# EAGLE schematic rgledtest (EAGLE 9.5.2)
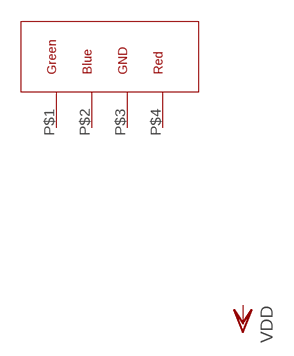
[diagram p0: schematic, sheet 1]

## Parts
U$1  RGBLED  [IC]
Unconnected: U$1.P$1 U$1.P$2 U$1.P$3 U$1.P$4

## Library data of the parts
U$1 = mylib:RGBLED